# EAGLE design SSOP-16 (EAGLE 6.2)
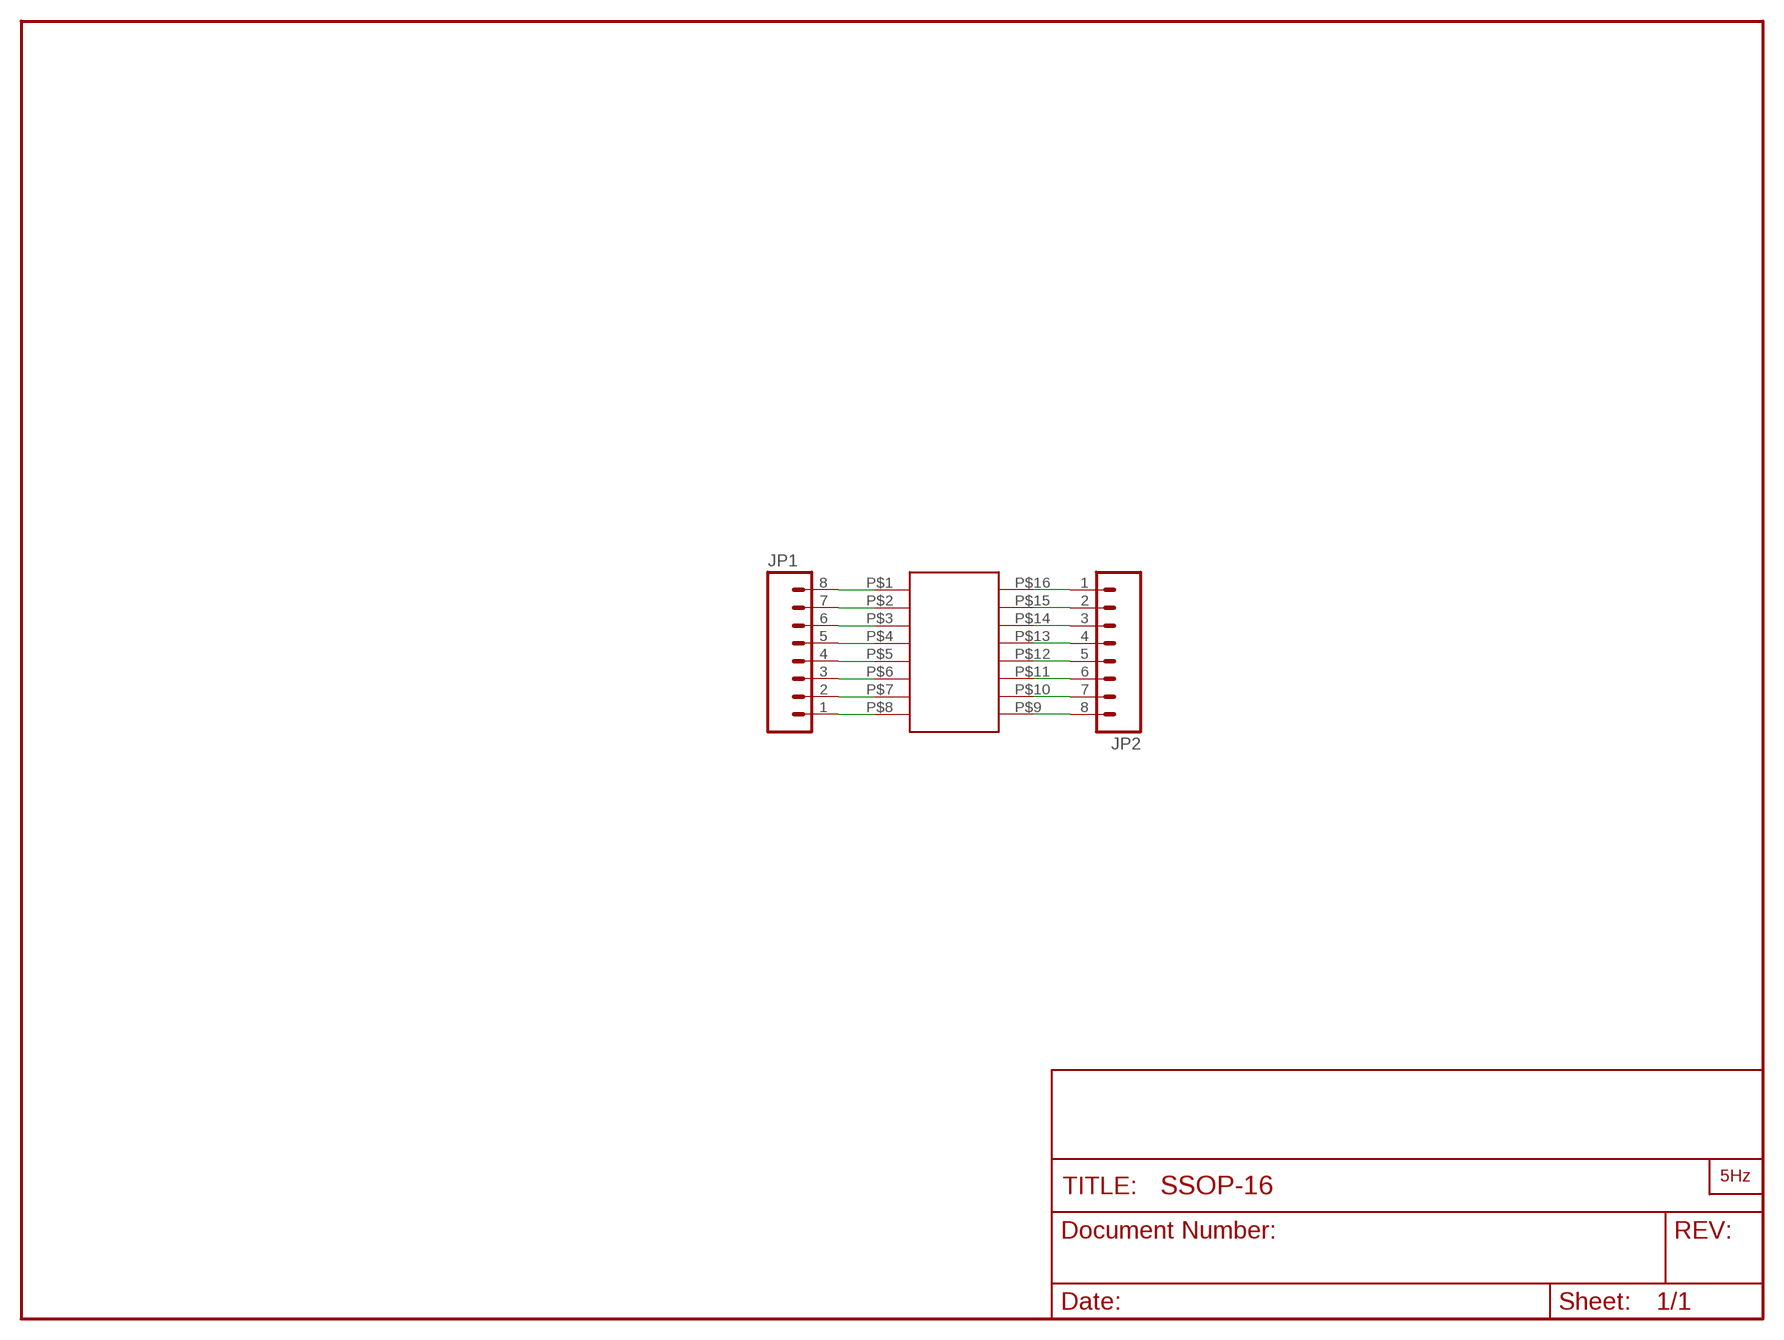
[diagram p0: schematic, sheet 1]

## Parts
JP1  M081X08  [1X08]
JP2  M081X08  [1X08]
U$1  SSOP-16SSOP-16  [SSOP-16]
U$2  LOGO2_SILK5MM  [LOGO2_5MM]

## Nets
N$1: JP1.1 U$1.P$8
N$2: JP1.2 U$1.P$7
N$3: JP1.3 U$1.P$6
N$4: JP1.4 U$1.P$5
N$5: JP1.5 U$1.P$4
N$6: JP1.6 U$1.P$3
N$7: JP1.7 U$1.P$2
N$8: JP1.8 U$1.P$1
N$9: JP2.1 U$1.P$16
N$10: JP2.2 U$1.P$15
N$11: JP2.3 U$1.P$14
N$12: JP2.4 U$1.P$13
N$13: JP2.5 U$1.P$12
N$14: JP2.6 U$1.P$11
N$15: JP2.7 U$1.P$10
N$16: JP2.8 U$1.P$9

## Library data of the parts
JP1 JP2 = SparkFun:M08: Header 8 Standard 8-pin 0.1" header. Use with straight break away headers (SKU : PRT-00116), right angle break away headers (PRT-00553), swiss pins (PRT-00743), machine pins (PRT-00117), and female headers (PRT-00115).
U$1 = MAÑE:SSOP-16
U$2 = LOGO:LOGO2_SILK: PRINCIPAL

## Board
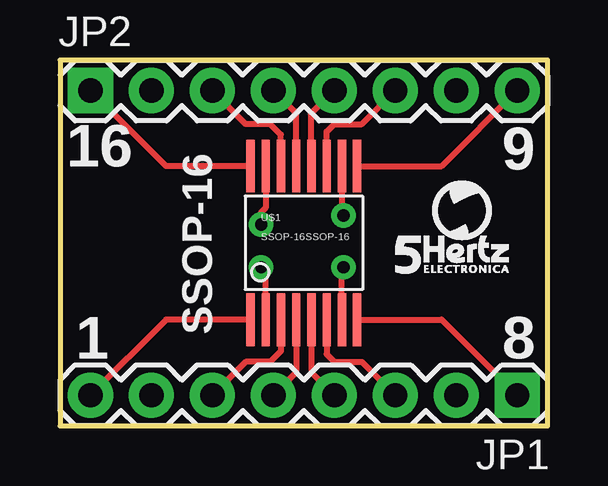
[diagram p1: board, top side]
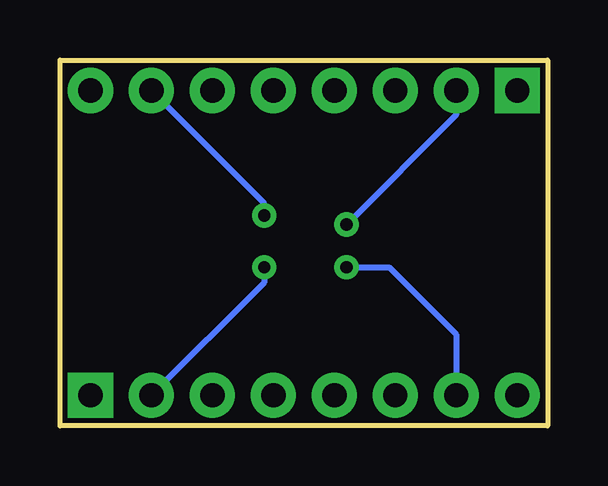
[diagram p2: board, bottom side, seen from below]

Size 20.32 x 15.24 mm. Coordinates in mm from the lower left corner, seen from the top.
Outline: 0,0 20.32,0 20.32,15.24 0,15.24 0,0
Copper layers (1*16): Top 0.035mm / dielectric 1.5mm / Bottom 0.035mm
Design rules: minimum track width 8mil, minimum drill 20mil, track to track 8mil, track to pad 8mil, pad to pad 8mil, via to via 8mil, smd to smd 8mil, copper to edge 10mil, drill to drill 8mil, minimum pad ring 12mil, minimum via ring 10mil, stop-mask expansion 4mil, vias tented up to drill 25mil, thermal gap 10mil

### Footprints (pad centres in the part's own frame; a part is rotated, then mirrored left to right if it is on the bottom)
1X08 = drill 1.016 pad 1.88 square: 1 0,0 | drill 1.016 pad 1.88: 2 2.54,0; 3 5.08,0; 4 7.62,0; 5 10.16,0; 6 12.7,0; 7 15.24,0; 8 17.78,0
SSOP-16 = smd 0.35 x 2.2: P$1 -2.223,-3.2; P$2 -1.587,-3.2; P$3 -0.953,-3.2; P$4 -0.318,-3.2; P$5 0.318,-3.2; P$6 0.953,-3.2; P$7 1.587,-3.2; P$8 2.223,-3.2; P$9 2.223,3.2; P$10 1.587,3.2; P$11 0.953,3.2; P$12 0.318,3.2; P$13 -0.318,3.2; P$14 -0.953,3.2; P$15 -1.587,3.2; P$16 -2.223,3.2

### Placement (x,y rotation side)
JP1  19.05,1.27 180 top
JP2  1.27,13.97 0 top
U$1  10.16,7.62 0 top
U$2  13.97,6.35 0 top

### Tracks (layer width: path | path; a pad name or v marks a point on that pad's centre or on a via)
N$1
  Top 0.254: U$1.P$8 15.9,4.42 JP1.1
N$2  (via drill 0.51)
  Top 0.254: U$1.P$7 11.75,6.54 v11.81,6.6
  Bottom 0.254: v11.81,6.6 11.81,5.97 JP1.2
N$3
  Top 0.254: U$1.P$6 11.11,2.98 11.43,2.67 12.57,2.67 JP1.3
N$4
  Top 0.254: U$1.P$5 10.48,2.22 JP1.4
N$5
  Top 0.254: U$1.P$4 9.84,2.22 JP1.5
N$6
  Top 0.254: U$1.P$3 9.21,3.11 8.76,2.67 7.75,2.67 JP1.6
N$7  (via drill 0.51)
  Top 0.254: U$1.P$2 8.57,6.41 v8.38,6.6
  Bottom 0.254: v8.38,6.6 6.6,6.6 3.81,3.81 JP1.7
N$8
  Top 0.254: U$1.P$1 4.42,4.42 JP1.8
N$9
  Top 0.254: U$1.P$16 4.42,10.82 JP2.1
N$10  (via drill 0.51)
  Top 0.254: v8.38,8.38 8.38,8.89 8.57,9.08 U$1.P$15
  Bottom 0.254: JP2.2 3.81,12.95 v8.38,8.38
N$11
  Top 0.254: U$1.P$14 9.21,12.13 8.76,12.57 7.75,12.57 JP2.3
N$12
  Top 0.254: U$1.P$13 9.84,13.02 JP2.4
N$13
  Top 0.254: U$1.P$12 10.48,13.02 JP2.5
N$14
  Top 0.254: U$1.P$11 11.11,12.26 11.43,12.57 12.57,12.57 JP2.6
N$15  (via drill 0.51)
  Top 0.254: U$1.P$10 11.75,8.83 v11.81,8.76
  Bottom 0.254: v11.81,8.76 11.81,9.27 JP2.7
N$16
  Top 0.254: U$1.P$9 15.9,10.82 JP2.8

### Text on the board
tPlace: 16 | 9 | SSOP-16 | 1 | 8